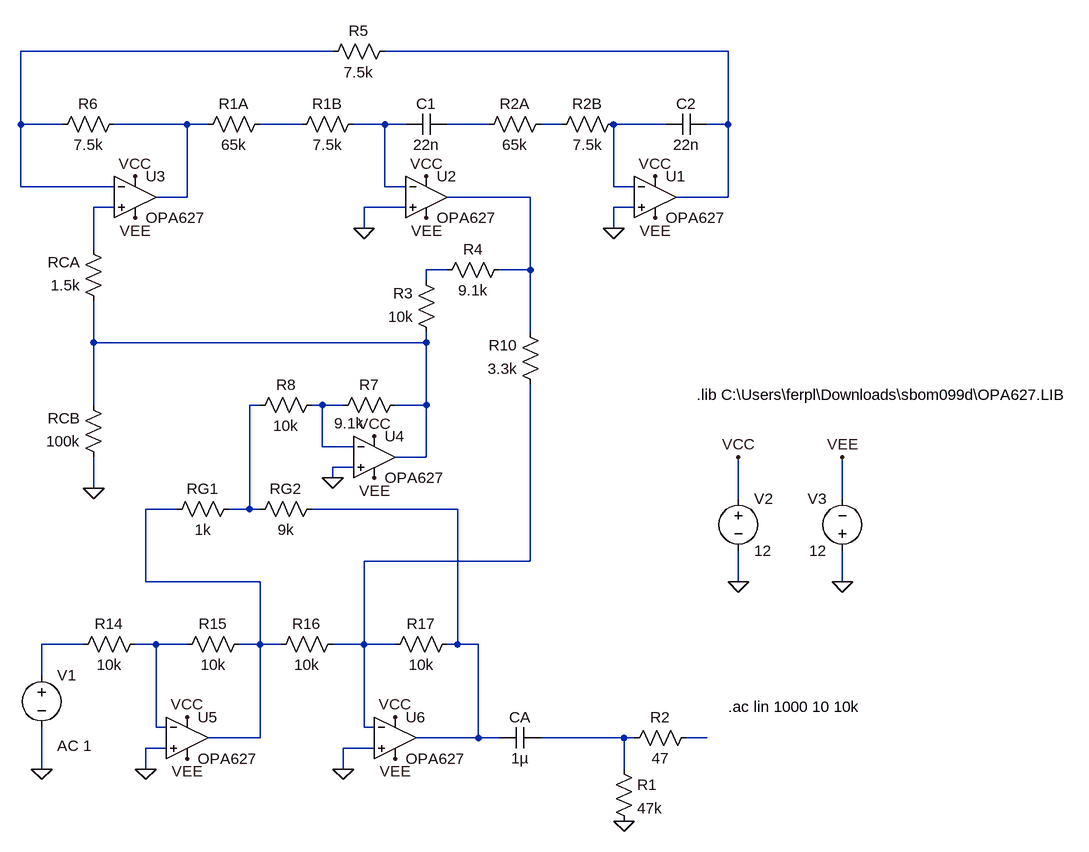
[diagram p0: schematic EQParametric.asc]
EQParametric.asc, the LTspice schematic file:
Version 4
SHEET 1 880 1060
WIRE -352 -144 -832 -144
WIRE 256 -144 -272 -144
WIRE -832 -32 -832 -144
WIRE -768 -32 -832 -32
WIRE -576 -32 -688 -32
WIRE -544 -32 -576 -32
WIRE -400 -32 -464 -32
WIRE -272 -32 -320 -32
WIRE -240 -32 -272 -32
WIRE -112 -32 -176 -32
WIRE 0 -32 -32 -32
WIRE 160 -32 80 -32
WIRE 256 -32 256 -144
WIRE 256 -32 224 -32
WIRE -832 64 -832 -32
WIRE -688 64 -832 64
WIRE -272 64 -272 -32
WIRE -240 64 -272 64
WIRE 80 64 80 -32
WIRE 112 64 80 64
WIRE -576 80 -576 -32
WIRE -576 80 -624 80
WIRE -48 80 -176 80
WIRE 256 80 256 -32
WIRE 256 80 176 80
WIRE -688 96 -720 96
WIRE -240 96 -304 96
WIRE 112 96 80 96
WIRE -304 128 -304 96
WIRE 80 128 80 96
WIRE -720 160 -720 96
WIRE -176 192 -208 192
WIRE -48 192 -48 80
WIRE -48 192 -96 192
WIRE -208 208 -208 192
WIRE -48 288 -48 192
WIRE -720 304 -720 240
WIRE -208 304 -208 288
WIRE -208 304 -720 304
WIRE -720 400 -720 304
WIRE -464 400 -480 400
WIRE -368 400 -384 400
WIRE -336 400 -368 400
WIRE -208 400 -208 304
WIRE -208 400 -256 400
WIRE -368 464 -368 400
WIRE -320 464 -368 464
WIRE -208 480 -208 400
WIRE -208 480 -256 480
WIRE -320 496 -352 496
WIRE -352 512 -352 496
WIRE -720 528 -720 480
WIRE 272 544 272 480
WIRE 432 544 432 480
WIRE -592 560 -640 560
WIRE -480 560 -480 400
WIRE -480 560 -512 560
WIRE -464 560 -480 560
WIRE -160 560 -384 560
WIRE -48 640 -48 368
WIRE -48 640 -304 640
WIRE -640 672 -640 560
WIRE -464 672 -640 672
WIRE 272 672 272 624
WIRE 432 672 432 624
WIRE -736 768 -800 768
WIRE -624 768 -656 768
WIRE -576 768 -624 768
WIRE -464 768 -464 672
WIRE -464 768 -496 768
WIRE -432 768 -464 768
WIRE -304 768 -304 640
WIRE -304 768 -352 768
WIRE -256 768 -304 768
WIRE -160 768 -160 560
WIRE -160 768 -176 768
WIRE -128 768 -160 768
WIRE -800 816 -800 768
WIRE -624 896 -624 768
WIRE -608 896 -624 896
WIRE -304 896 -304 768
WIRE -288 896 -304 896
WIRE -464 912 -464 768
WIRE -464 912 -544 912
WIRE -128 912 -128 768
WIRE -128 912 -224 912
WIRE -96 912 -128 912
WIRE 96 912 -32 912
WIRE 112 912 96 912
WIRE 224 912 192 912
WIRE -608 928 -640 928
WIRE -288 928 -336 928
WIRE -800 960 -800 896
WIRE -640 960 -640 928
WIRE -336 960 -336 928
WIRE 96 960 96 912
FLAG -720 528 0
FLAG -304 128 0
FLAG 80 128 0
FLAG -640 960 0
FLAG -336 960 0
FLAG -800 960 0
FLAG -352 512 0
FLAG 272 672 0
FLAG 432 672 0
FLAG 272 480 VCC
FLAG 432 480 VEE
FLAG -656 48 VCC
FLAG -208 48 VCC
FLAG 144 48 VCC
FLAG -288 448 VCC
FLAG -256 880 VCC
FLAG -576 880 VCC
FLAG -656 112 VEE
FLAG -208 112 VEE
FLAG 144 112 VEE
FLAG -288 512 VEE
FLAG -256 944 VEE
FLAG -576 944 VEE
FLAG 96 1040 0
SYMBOL OpAmps\\opamp2 144 16 R0
SYMATTR InstName U1
SYMATTR Value OPA627
SYMBOL OpAmps\\opamp2 -208 16 R0
SYMATTR InstName U2
SYMATTR Value OPA627
SYMBOL OpAmps\\opamp2 -656 16 R0
SYMATTR InstName U3
SYMATTR Value OPA627
SYMBOL OpAmps\\opamp2 -288 416 R0
SYMATTR InstName U4
SYMATTR Value OPA627
SYMBOL OpAmps\\opamp2 -576 848 R0
SYMATTR InstName U5
SYMATTR Value OPA627
SYMBOL OpAmps\\opamp2 -256 848 R0
SYMATTR InstName U6
SYMATTR Value OPA627
SYMBOL res -672 -48 R90
WINDOW 0 0 56 VBottom 2
WINDOW 3 32 56 VTop 2
SYMATTR InstName R6
SYMATTR Value 7.5k
SYMBOL res -448 -48 R90
WINDOW 0 0 56 VBottom 2
WINDOW 3 32 56 VTop 2
SYMATTR InstName R1A
SYMATTR Value 65k
SYMBOL res -304 -48 R90
WINDOW 0 0 56 VBottom 2
WINDOW 3 32 56 VTop 2
SYMATTR InstName R1B
SYMATTR Value 7.5k
SYMBOL res -16 -48 R90
WINDOW 0 0 56 VBottom 2
WINDOW 3 32 56 VTop 2
SYMATTR InstName R2A
SYMATTR Value 65k
SYMBOL res 96 -48 R90
WINDOW 0 0 56 VBottom 2
WINDOW 3 32 56 VTop 2
SYMATTR InstName R2B
SYMATTR Value 7.5k
SYMBOL res -256 -160 R90
WINDOW 0 0 56 VBottom 2
WINDOW 3 32 56 VTop 2
SYMATTR InstName R5
SYMATTR Value 7.5k
SYMBOL res -704 256 R180
WINDOW 0 36 76 Left 2
WINDOW 3 36 40 Left 2
SYMATTR InstName RCA
SYMATTR Value 1.5k
SYMBOL res -704 496 R180
WINDOW 0 36 76 Left 2
WINDOW 3 36 40 Left 2
SYMATTR InstName RCB
SYMATTR Value 100k
SYMBOL res -480 416 R270
WINDOW 0 32 56 VTop 2
WINDOW 3 0 56 VBottom 2
SYMATTR InstName R8
SYMATTR Value 10k
SYMBOL res -352 416 R270
WINDOW 0 32 56 VTop 2
WINDOW 3 4 25 VBottom 2
SYMATTR InstName R7
SYMATTR Value 9.1k
SYMBOL res -192 304 R180
WINDOW 0 36 76 Left 2
WINDOW 3 36 40 Left 2
SYMATTR InstName R3
SYMATTR Value 10k
SYMBOL res -192 208 R270
WINDOW 0 32 56 VTop 2
WINDOW 3 0 56 VBottom 2
SYMATTR InstName R4
SYMATTR Value 9.1k
SYMBOL cap 224 -48 R90
WINDOW 0 0 32 VBottom 2
WINDOW 3 32 32 VTop 2
SYMATTR InstName C2
SYMATTR Value 22n
SYMBOL cap -176 -48 R90
WINDOW 0 0 32 VBottom 2
WINDOW 3 32 32 VTop 2
SYMATTR InstName C1
SYMATTR Value 22n
SYMBOL res -496 544 R90
WINDOW 0 0 56 VBottom 2
WINDOW 3 32 56 VTop 2
SYMATTR InstName RG1
SYMATTR Value 1k
SYMBOL res -368 544 R90
WINDOW 0 0 56 VBottom 2
WINDOW 3 32 56 VTop 2
SYMATTR InstName RG2
SYMATTR Value 9k
SYMBOL res -32 384 R180
WINDOW 0 36 76 Left 2
WINDOW 3 36 40 Left 2
SYMATTR InstName R10
SYMATTR Value 3.3k
SYMBOL res -640 752 R90
WINDOW 0 0 56 VBottom 2
WINDOW 3 32 56 VTop 2
SYMATTR InstName R14
SYMATTR Value 10k
SYMBOL res -480 752 R90
WINDOW 0 0 56 VBottom 2
WINDOW 3 32 56 VTop 2
SYMATTR InstName R15
SYMATTR Value 10k
SYMBOL res -336 752 R90
WINDOW 0 0 56 VBottom 2
WINDOW 3 32 56 VTop 2
SYMATTR InstName R16
SYMATTR Value 10k
SYMBOL res -160 752 R90
WINDOW 0 0 56 VBottom 2
WINDOW 3 32 56 VTop 2
SYMATTR InstName R17
SYMATTR Value 10k
SYMBOL voltage -800 800 R0
WINDOW 123 24 124 Left 2
WINDOW 39 0 0 Left 0
SYMATTR InstName V1
SYMATTR Value ""
SYMATTR Value2 AC 1
SYMBOL cap -32 896 R90
WINDOW 0 0 32 VBottom 2
WINDOW 3 32 32 VTop 2
SYMATTR InstName CA
SYMATTR Value 1µ
SYMBOL voltage 272 528 R0
WINDOW 123 0 0 Left 0
WINDOW 39 0 0 Left 0
SYMATTR InstName V2
SYMATTR Value 12
SYMBOL voltage 432 640 R180
WINDOW 0 24 96 Left 2
WINDOW 3 24 16 Left 2
WINDOW 123 0 0 Left 0
WINDOW 39 0 0 Left 0
SYMATTR InstName V3
SYMATTR Value 12
SYMBOL res 80 944 R0
SYMATTR InstName R1
SYMATTR Value 47k
SYMBOL res 208 896 R90
WINDOW 0 0 56 VBottom 2
WINDOW 3 32 56 VTop 2
SYMATTR InstName R2
SYMATTR Value 47
TEXT 208 384 Left 2 !.lib C:\\Users\\ferpl\\Downloads\\sbom099d\\OPA627.LIB
TEXT 256 864 Left 2 !.ac lin 1000 10 10k

The netlist it stands for:
* EQParametric.asc
XU1 0 N008 VCC VEE N002 OPA627  ; pins In+ In- V+ V- OUT
XU2 0 N005 VCC VEE N009 OPA627  ; pins In+ In- V+ V- OUT
XU3 N010 N001 VCC VEE N003 OPA627  ; pins In+ In- V+ V- OUT
XU4 0 N014 VCC VEE N012 OPA627  ; pins In+ In- V+ V- OUT
XU5 0 N019 VCC VEE N015 OPA627  ; pins In+ In- V+ V- OUT
XU6 0 N017 VCC VEE N016 OPA627  ; pins In+ In- V+ V- OUT
R6 N003 N001 7.5k
R1A N004 N003 65k
R1B N005 N004 7.5k
R2A N007 N006 65k
R2B N008 N007 7.5k
R5 N002 N001 7.5k
RCA N012 N010 1.5k
RCB 0 N012 100k
R8 N013 N014 10k
R7 N014 N012 9.1k
R3 N012 N011 10k
R4 N011 N009 9.1k
C2 N002 N008 22n
C1 N006 N005 22n
RG1 N013 N015 1k
RG2 N016 N013 9k
R10 N017 N009 3.3k
R14 N019 N018 10k
R15 N015 N019 10k
R16 N017 N015 10k
R17 N016 N017 10k
V1 N018 0 AC 1
CA N020 N016 1µ
V2 VCC 0 12
V3 0 VEE 12
R1 N020 0 47k
R2 N021 N020 47
.lib C:\Users\ferpl\Downloads\sbom099d\OPA627.LIB
.ac lin 1000 10 10k
.backanno
.end